# EAGLE schematic 4XKanda_1276_NoBME (EAGLE 7.7.0)

## Sheet 1 of 4
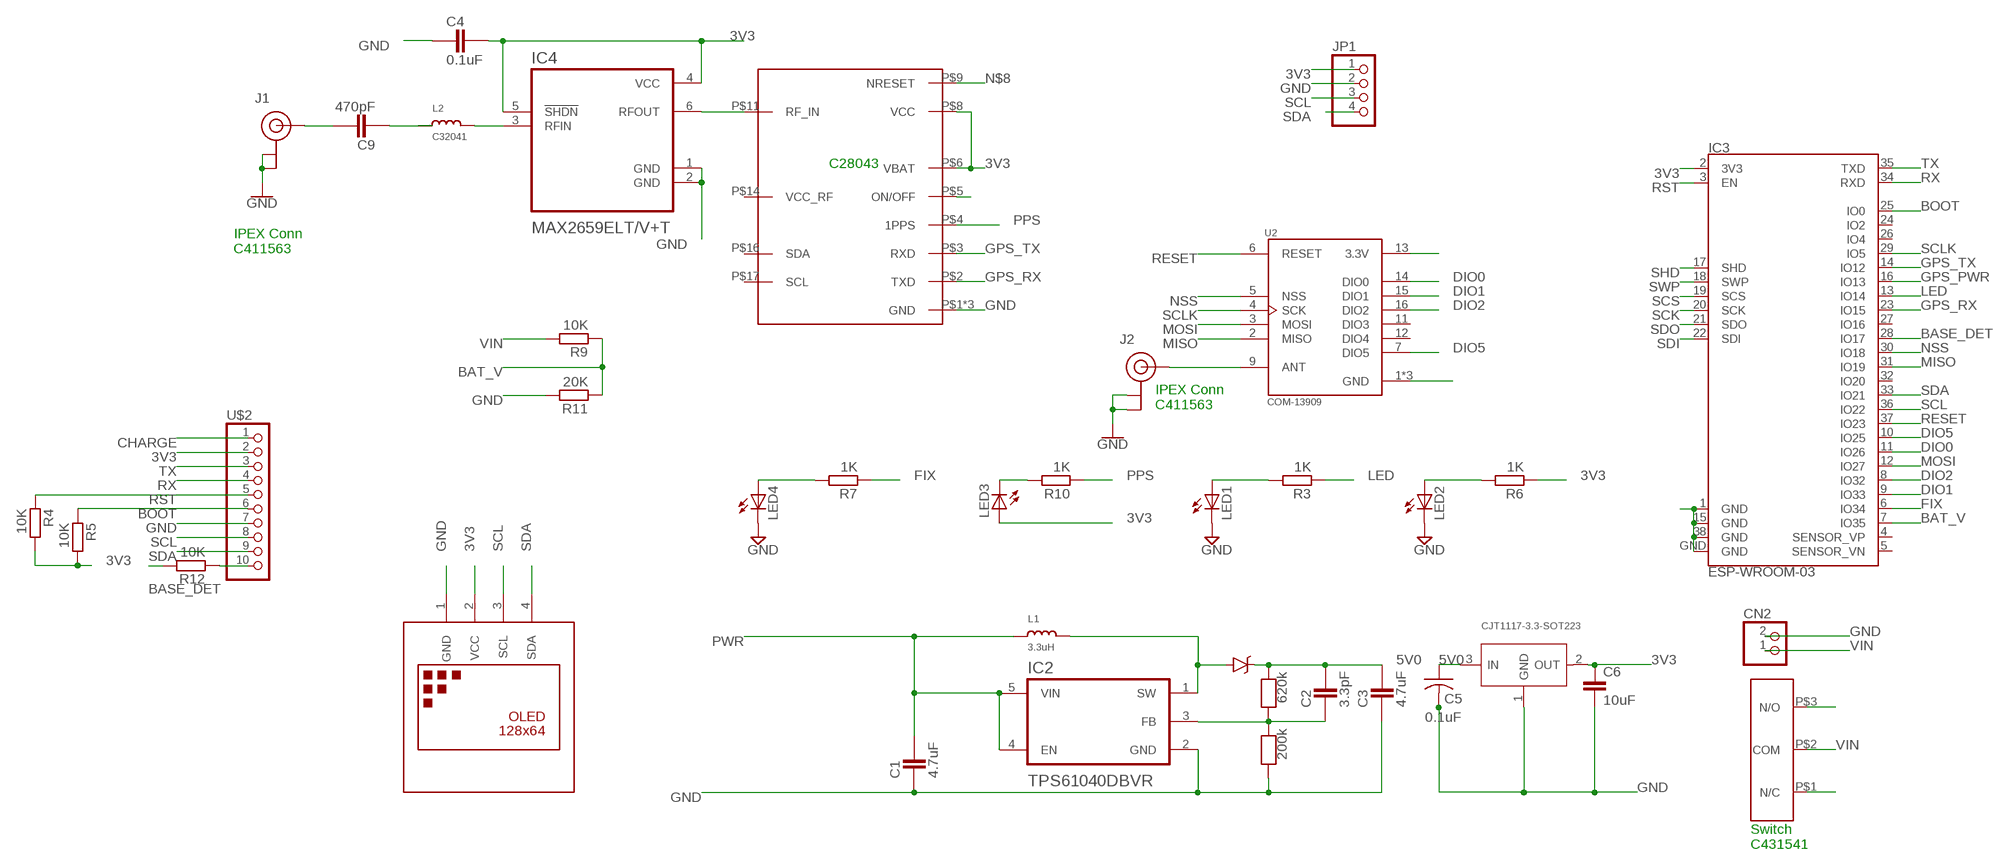
[diagram p0: schematic, sheet 1]

### Parts
C1  4.7uF  CAPACITOR_0603  [CAPC1608X92N]
C2  3.3pF  CAPACITOR_0402  [CAPC1005X60N]
C3  4.7uF  CAPACITOR_0603  [CAPC1608X92N]
C4  0.1uF  CAPACITOR_0603  [CAPC1608X92N]
C5  0.1uF  C-USC0805  [C0805]
C6  10uF  C-EUC0805  [C0805@1]
C9  470pF  CAPACITOR_0603  [CAPC1608X92N]
CN2  JST_2PIN-THM  [JST-PH-2-THM]
D1  BA340A  B340A  [SMA-DIODE]
IC1  CJT1117-3.3-SOT223  PMIC-CJT1117-3.3(SOT223)  [SOT-223]
IC2  TPS61040DBVR  [SOT95P280X145-5N]
IC3  ESP-WROOM-03  [ESP-WROOM-03]
IC4  MAX2659ELT/V+T  [SON50P150X100X80-6N]
IC54  ATGM336H  [ATGM336H]
J1  U.FL  [U.FL]
J2  U.FL  [U.FL]
JP1  HEADER-1X4ROUND  [1X04_ROUND]
L1  3.3uH  INDUCTORNR5040  [INDUCTOR_5X5MM_NR5040_NOTHERMALS]
L2  C32041  INDUCTOR_0402  [_0402]
LED1  LEDSML0805  [SML0805]
LED2  LEDSML0805  [SML0805]
LED3  LEDSML0805  [SML0805]
LED4  LEDSML0805  [SML0805]
R1  620k  RESISTOR0603  [0603]
R2  200k  RESISTOR0603  [0603]
R3  1K  RESISTOR_0603  [RESC1608X55N]
R4  10K  RESISTOR_0603  [RESC1608X55N]
R5  10K  RESISTOR_0603  [RESC1608X55N]
R6  1K  RESISTOR_0805  [RESC2012X70N]
R7  1K  RESISTOR_0603  [RESC1608X55N]
R9  10K  RESISTOR_0603  [RESC1608X55N]
R10  1K  RESISTOR_0603  [RESC1608X55N]
R11  20K  RESISTOR_0603  [RESC1608X55N]
R12  10K  RESISTOR_0603  [RESC1608X55N]
S1  SMD-SWITCH  [SMD-SWITCH]
U2  COM-13909  [MOD_COM-13909]
U$1  DISPLAY-OLED-128X64-I2C  [DISPLAY-OLED-128X64-I2C]
U$2  HEADER-1X10ROUND  [1X10_ROUND]

### Nets
3V3: C4.2 C6.1 IC1.2(OUT) IC3.2(3V3) IC4.4(VCC) IC4.5(!SHDN) IC54.P$6(VBAT) IC54.P$8(VCC) JP1.1 LED3.A R4.2 R5.2 R6.1 U2.13(3.3V) U$1.2(VCC) U$2.2 ; also sheet 2,3,4
5V0: C2.2 C3.2 C5.1 D1.C IC1.3(IN) R1.1 ; also sheet 2,3,4
ANT: J2.FEED(SIGNAL) U2.9(ANT)
BASE_DET: IC3.28(IO17) R12.2 ; also sheet 2,3,4
BAT_V: IC3.7(IO35) R9.1 R11.1 ; also sheet 2,3,4
BOOT: IC3.25(IO0) R5.1 U$2.6 ; also sheet 2,3,4
CHARGE: S1.P$3(N/O) U$2.1 ; also sheet 2,3,4
DIO0: IC3.11(IO26) U2.14(DIO0) ; also sheet 2,3,4
DIO1: IC3.9(IO33) U2.15(DIO1) ; also sheet 2,3,4
DIO2: IC3.8(IO32) U2.16(DIO2) ; also sheet 2,3,4
DIO5: IC3.10(IO25) U2.7(DIO5) ; also sheet 2,3,4
FB: C2.1 IC2.3(FB) R1.2 R2.1
FIX: IC3.6(IO34) R7.1 ; also sheet 2,3,4
GND: C1.1 C3.1 C4.1 C5.2 C6.2 CN2.2 IC1.1(GND) IC2.2(GND) IC3.1(GND) IC3.15(GND) IC3.38(GND) IC3.GND IC4.1(GND) IC4.2(GND) IC54.P$1(GND) IC54.P$10(GND) IC54.P$12(GND) J1.1(GND) J1.2(GND) J2.1(GND) J2.2(GND) JP1.2 LED1.C LED2.C LED4.C R2.2 R11.2 U2.1(GND) U2.8(GND) U2.10(GND) U$1.1(GND) U$2.7 ; also sheet 2,3,4
GPS_PWR: IC3.16(IO13) ; also sheet 2,3,4
GPS_RX: IC3.23(IO15) IC54.P$2(TXD) ; also sheet 2,3,4
GPS_TX: IC3.14(IO12) IC54.P$3(RXD) ; also sheet 2,3,4
LED: IC3.13(IO14) R3.1 ; also sheet 2,3,4
MISO: IC3.31(IO19) U2.2(MISO) ; also sheet 2,3,4
MOSI: IC3.12(IO27) U2.3(MOSI) ; also sheet 2,3,4
N$1: D1.A IC2.1(SW) L1.P$2
N$2: LED2.A R6.2
N$3: LED1.A R3.2
N$4: C9.2 J1.FEED(SIGNAL)
N$5: LED4.A R7.2
N$6: IC4.6(RFOUT) IC54.P$11(RF_IN)
N$7: LED3.C R10.2
N$8: IC54.P$9(NRESET) ; also sheet 2,3,4
N$9: IC54.P$5(ON/OFF)
N$11: IC4.3(RFIN) L2.2
N$12: C9.1 L2.1
N$13: R12.1 U$2.10
NSS: IC3.30(IO18) U2.5(NSS) ; also sheet 2,3,4
PPS: IC54.P$4(1PPS) R10.1 ; also sheet 2,3,4
PWR: C1.2 IC2.4(EN) IC2.5(VIN) L1.P$1 S1.P$1(N/C) ; also sheet 2,3,4
RESET: IC3.37(IO23) U2.6(RESET) ; also sheet 2,3,4
RST: IC3.3(EN) R4.1 U$2.5 ; also sheet 2,3,4
RX: IC3.34(RXD) U$2.4 ; also sheet 2,3,4
SCK: IC3.20(SCK) ; also sheet 2,3,4
SCL: IC3.36(IO22) JP1.3 U$1.3(SCL) U$2.8 ; also sheet 2,3,4
SCLK: IC3.29(IO5) U2.4(SCK) ; also sheet 2,3,4
SCS: IC3.19(SCS) ; also sheet 2,3,4
SDA: IC3.33(IO21) JP1.4 U$1.4(SDA) U$2.9 ; also sheet 2,3,4
SDI: IC3.22(SDI) ; also sheet 2,3,4
SDO: IC3.21(SDO) ; also sheet 2,3,4
SHD: IC3.17(SHD) ; also sheet 2,3,4
SWP: IC3.18(SWP) ; also sheet 2,3,4
TX: IC3.35(TXD) U$2.3 ; also sheet 2,3,4
VIN: CN2.1 R9.2 S1.P$2(COM) ; also sheet 2,3,4
Unconnected: IC3.4(SENSOR_VP) IC3.5(SENSOR_VN) IC3.24(IO2) IC3.26(IO4) IC3.27(IO16) IC3.32(IO20) IC54.P$14(VCC_RF) IC54.P$16(SDA) IC54.P$17(SCL) U2.11(DIO3) U2.12(DIO4)

### Notes on the sheet
- C28043
- IPEX Conn
  C411563
- IPEX Conn
  C411563
- Switch
  C431541

## Sheet 2 of 4
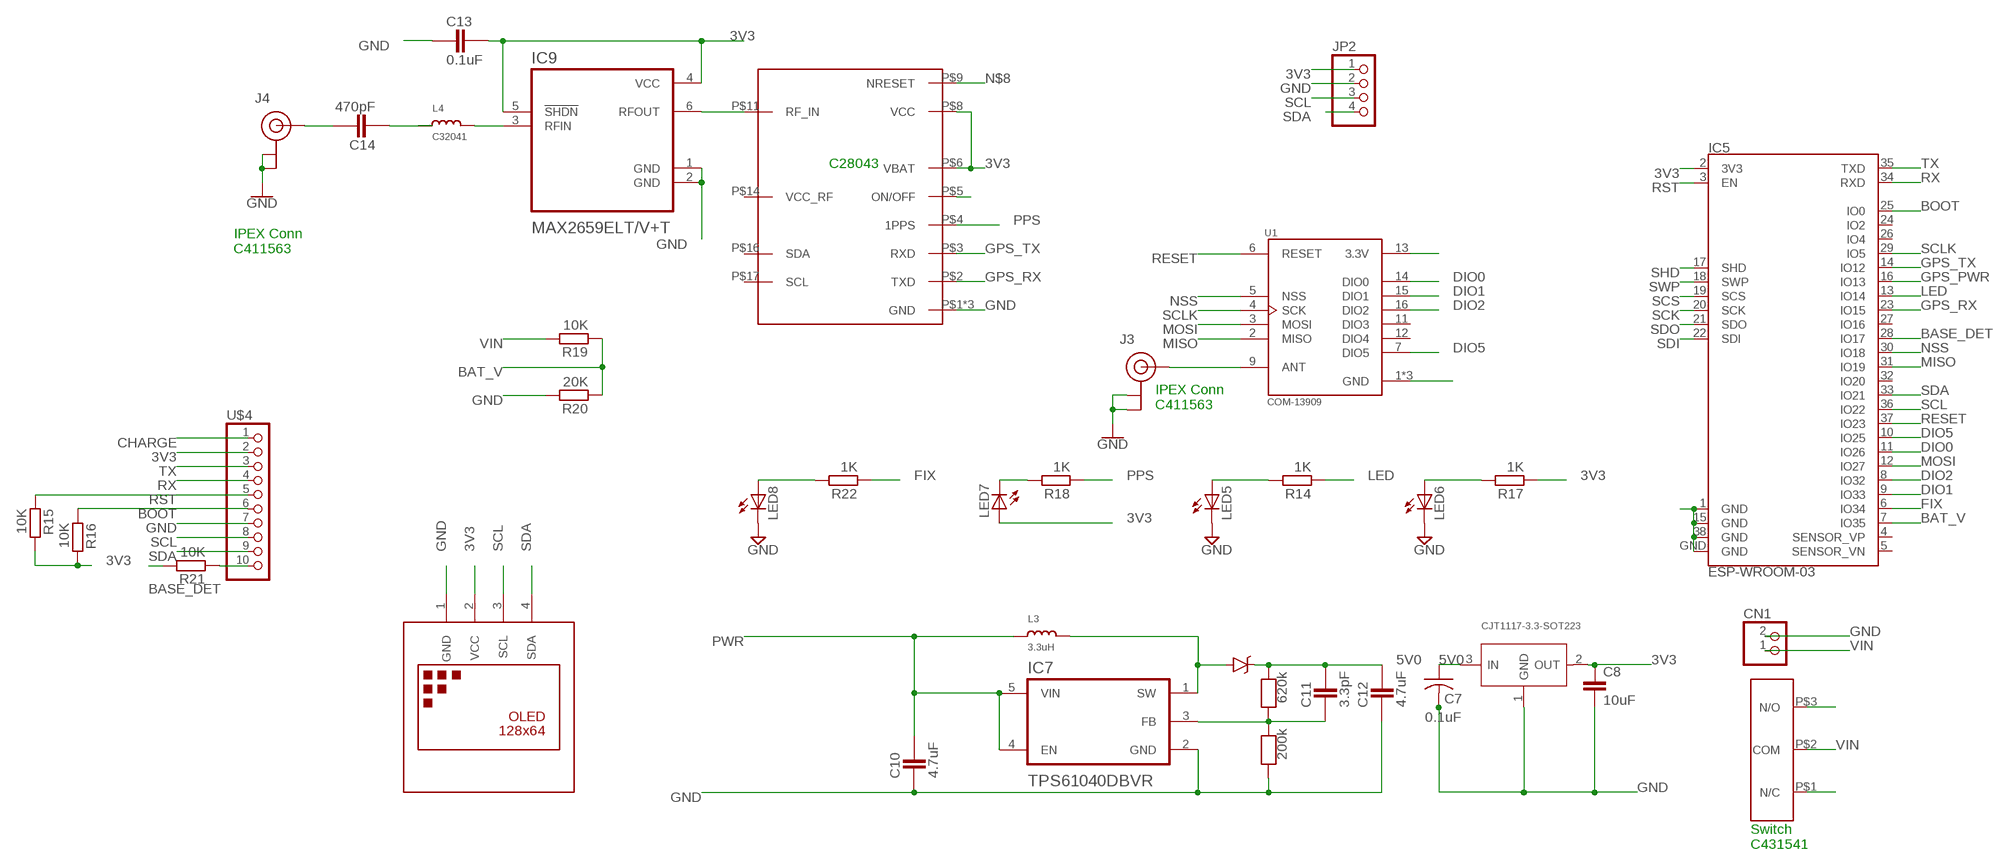
[diagram p1: schematic, sheet 2]

### Parts
C7  0.1uF  C-USC0805  [C0805]
C8  10uF  C-EUC0805  [C0805@1]
C10  4.7uF  CAPACITOR_0603  [CAPC1608X92N]
C11  3.3pF  CAPACITOR_0402  [CAPC1005X60N]
C12  4.7uF  CAPACITOR_0603  [CAPC1608X92N]
C13  0.1uF  CAPACITOR_0603  [CAPC1608X92N]
C14  470pF  CAPACITOR_0603  [CAPC1608X92N]
CN1  JST_2PIN-THM  [JST-PH-2-THM]
D2  BA340A  B340A  [SMA-DIODE]
IC5  ESP-WROOM-03  [ESP-WROOM-03]
IC6  CJT1117-3.3-SOT223  PMIC-CJT1117-3.3(SOT223)  [SOT-223]
IC7  TPS61040DBVR  [SOT95P280X145-5N]
IC8  ATGM336H  [ATGM336H]
IC9  MAX2659ELT/V+T  [SON50P150X100X80-6N]
J3  U.FL  [U.FL]
J4  U.FL  [U.FL]
JP2  HEADER-1X4ROUND  [1X04_ROUND]
L3  3.3uH  INDUCTORNR5040  [INDUCTOR_5X5MM_NR5040_NOTHERMALS]
L4  C32041  INDUCTOR_0402  [_0402]
LED5  LEDSML0805  [SML0805]
LED6  LEDSML0805  [SML0805]
LED7  LEDSML0805  [SML0805]
LED8  LEDSML0805  [SML0805]
R8  620k  RESISTOR0603  [0603]
R13  200k  RESISTOR0603  [0603]
R14  1K  RESISTOR_0603  [RESC1608X55N]
R15  10K  RESISTOR_0603  [RESC1608X55N]
R16  10K  RESISTOR_0603  [RESC1608X55N]
R17  1K  RESISTOR_0805  [RESC2012X70N]
R18  1K  RESISTOR_0603  [RESC1608X55N]
R19  10K  RESISTOR_0603  [RESC1608X55N]
R20  20K  RESISTOR_0603  [RESC1608X55N]
R21  10K  RESISTOR_0603  [RESC1608X55N]
R22  1K  RESISTOR_0603  [RESC1608X55N]
S2  SMD-SWITCH  [SMD-SWITCH]
U1  COM-13909  [MOD_COM-13909]
U$3  DISPLAY-OLED-128X64-I2C  [DISPLAY-OLED-128X64-I2C]
U$4  HEADER-1X10ROUND  [1X10_ROUND]

### Nets
3V3: C8.1 C13.2 IC5.2(3V3) IC6.2(OUT) IC8.P$6(VBAT) IC8.P$8(VCC) IC9.4(VCC) IC9.5(!SHDN) JP2.1 LED7.A R15.2 R16.2 R17.1 U1.13(3.3V) U$3.2(VCC) U$4.2 ; also sheet 1,3,4
5V0: C7.1 C11.2 C12.2 D2.C IC6.3(IN) R8.1 ; also sheet 1,3,4
ANT1: J3.FEED(SIGNAL) U1.9(ANT)
BASE_DET: IC5.28(IO17) R21.2 ; also sheet 1,3,4
BAT_V: IC5.7(IO35) R19.1 R20.1 ; also sheet 1,3,4
BOOT: IC5.25(IO0) R16.1 U$4.6 ; also sheet 1,3,4
CHARGE: S2.P$3(N/O) U$4.1 ; also sheet 1,3,4
DIO0: IC5.11(IO26) U1.14(DIO0) ; also sheet 1,3,4
DIO1: IC5.9(IO33) U1.15(DIO1) ; also sheet 1,3,4
DIO2: IC5.8(IO32) U1.16(DIO2) ; also sheet 1,3,4
DIO5: IC5.10(IO25) U1.7(DIO5) ; also sheet 1,3,4
FB1: C11.1 IC7.3(FB) R8.2 R13.1
FIX: IC5.6(IO34) R22.1 ; also sheet 1,3,4
GND: C7.2 C8.2 C10.1 C12.1 C13.1 CN1.2 IC5.1(GND) IC5.15(GND) IC5.38(GND) IC5.GND IC6.1(GND) IC7.2(GND) IC8.P$1(GND) IC8.P$10(GND) IC8.P$12(GND) IC9.1(GND) IC9.2(GND) J3.1(GND) J3.2(GND) J4.1(GND) J4.2(GND) JP2.2 LED5.C LED6.C LED8.C R13.2 R20.2 U1.1(GND) U1.8(GND) U1.10(GND) U$3.1(GND) U$4.7 ; also sheet 1,3,4
GPS_PWR: IC5.16(IO13) ; also sheet 1,3,4
GPS_RX: IC5.23(IO15) IC8.P$2(TXD) ; also sheet 1,3,4
GPS_TX: IC5.14(IO12) IC8.P$3(RXD) ; also sheet 1,3,4
LED: IC5.13(IO14) R14.1 ; also sheet 1,3,4
MISO: IC5.31(IO19) U1.2(MISO) ; also sheet 1,3,4
MOSI: IC5.12(IO27) U1.3(MOSI) ; also sheet 1,3,4
N$8: IC8.P$9(NRESET) ; also sheet 1,3,4
N$10: D2.A IC7.1(SW) L3.P$2
N$14: LED5.A R14.2
N$15: LED6.A R17.2
N$16: C14.2 J4.FEED(SIGNAL)
N$17: LED7.C R18.2
N$18: IC8.P$5(ON/OFF)
N$19: IC8.P$11(RF_IN) IC9.6(RFOUT)
N$20: IC9.3(RFIN) L4.2
N$21: C14.1 L4.1
N$22: R21.1 U$4.10
N$23: LED8.A R22.2
NSS: IC5.30(IO18) U1.5(NSS) ; also sheet 1,3,4
PPS: IC8.P$4(1PPS) R18.1 ; also sheet 1,3,4
PWR: C10.2 IC7.4(EN) IC7.5(VIN) L3.P$1 S2.P$1(N/C) ; also sheet 1,3,4
RESET: IC5.37(IO23) U1.6(RESET) ; also sheet 1,3,4
RST: IC5.3(EN) R15.1 U$4.5 ; also sheet 1,3,4
RX: IC5.34(RXD) U$4.4 ; also sheet 1,3,4
SCK: IC5.20(SCK) ; also sheet 1,3,4
SCL: IC5.36(IO22) JP2.3 U$3.3(SCL) U$4.8 ; also sheet 1,3,4
SCLK: IC5.29(IO5) U1.4(SCK) ; also sheet 1,3,4
SCS: IC5.19(SCS) ; also sheet 1,3,4
SDA: IC5.33(IO21) JP2.4 U$3.4(SDA) U$4.9 ; also sheet 1,3,4
SDI: IC5.22(SDI) ; also sheet 1,3,4
SDO: IC5.21(SDO) ; also sheet 1,3,4
SHD: IC5.17(SHD) ; also sheet 1,3,4
SWP: IC5.18(SWP) ; also sheet 1,3,4
TX: IC5.35(TXD) U$4.3 ; also sheet 1,3,4
VIN: CN1.1 R19.2 S2.P$2(COM) ; also sheet 1,3,4
Unconnected: IC5.4(SENSOR_VP) IC5.5(SENSOR_VN) IC5.24(IO2) IC5.26(IO4) IC5.27(IO16) IC5.32(IO20) IC8.P$14(VCC_RF) IC8.P$16(SDA) IC8.P$17(SCL) U1.11(DIO3) U1.12(DIO4)

### Notes on the sheet
- C28043
- IPEX Conn
  C411563
- IPEX Conn
  C411563
- Switch
  C431541

## Sheet 3 of 4
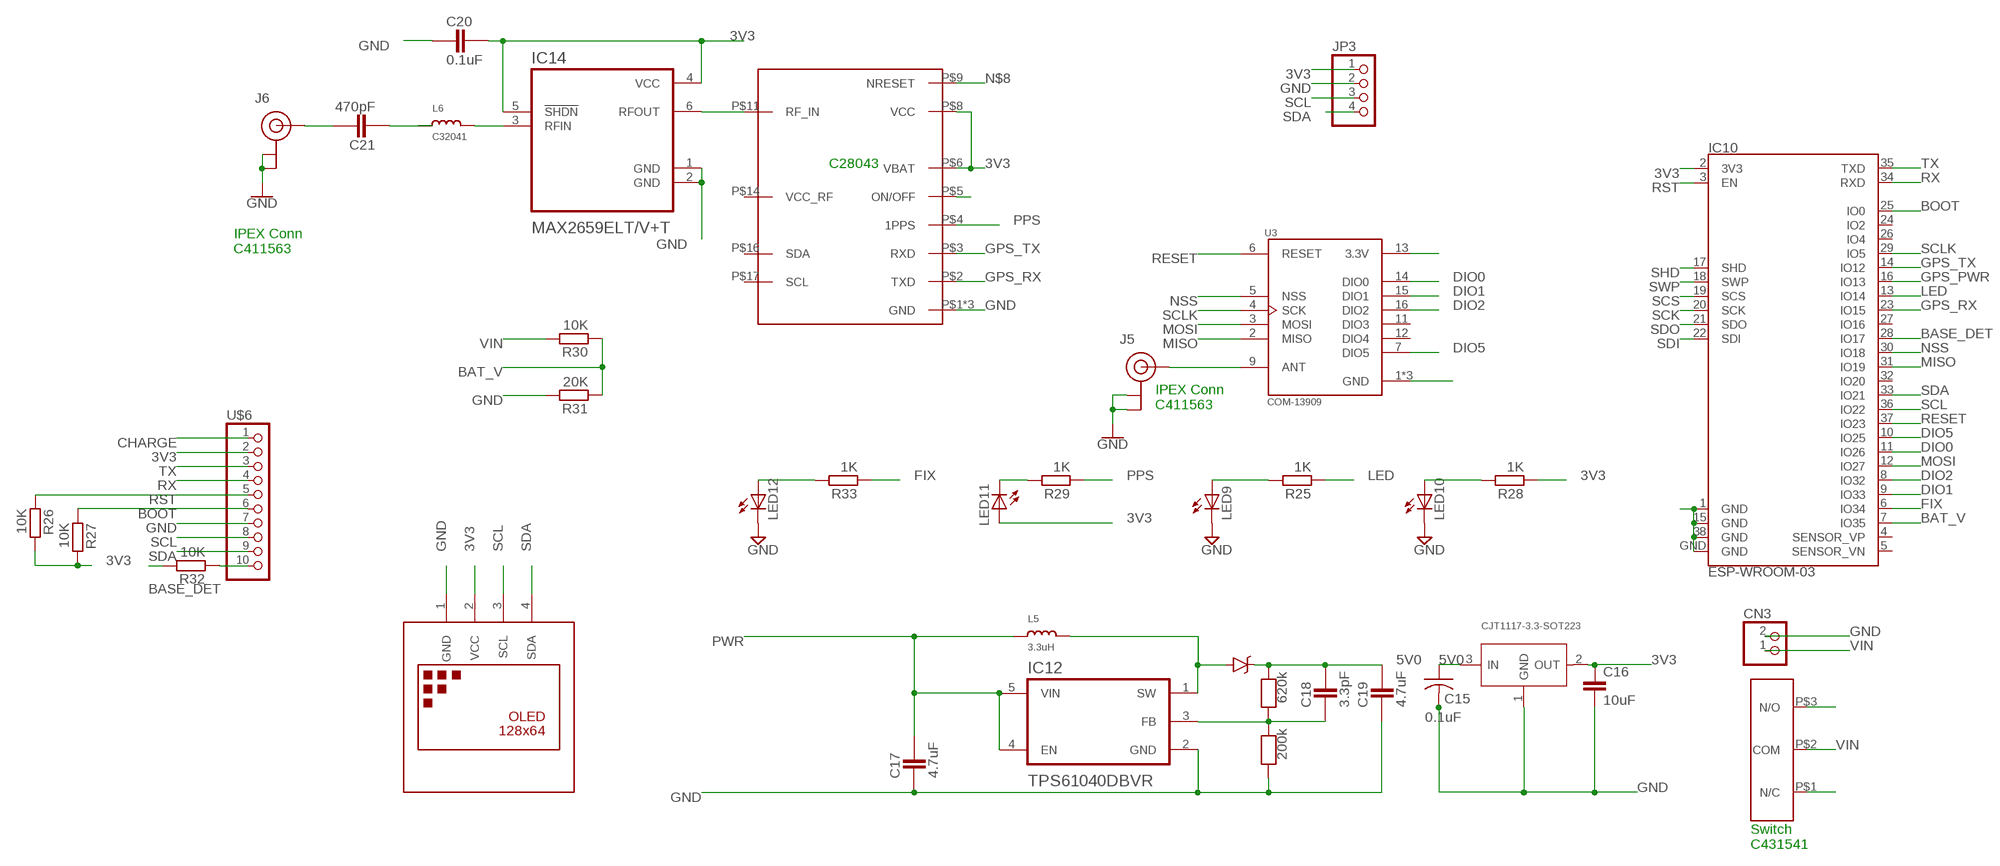
[diagram p2: schematic, sheet 3]

### Parts
C15  0.1uF  C-USC0805  [C0805]
C16  10uF  C-EUC0805  [C0805@1]
C17  4.7uF  CAPACITOR_0603  [CAPC1608X92N]
C18  3.3pF  CAPACITOR_0402  [CAPC1005X60N]
C19  4.7uF  CAPACITOR_0603  [CAPC1608X92N]
C20  0.1uF  CAPACITOR_0603  [CAPC1608X92N]
C21  470pF  CAPACITOR_0603  [CAPC1608X92N]
CN3  JST_2PIN-THM  [JST-PH-2-THM]
D3  BA340A  B340A  [SMA-DIODE]
IC10  ESP-WROOM-03  [ESP-WROOM-03]
IC11  CJT1117-3.3-SOT223  PMIC-CJT1117-3.3(SOT223)  [SOT-223]
IC12  TPS61040DBVR  [SOT95P280X145-5N]
IC13  ATGM336H  [ATGM336H]
IC14  MAX2659ELT/V+T  [SON50P150X100X80-6N]
J5  U.FL  [U.FL]
J6  U.FL  [U.FL]
JP3  HEADER-1X4ROUND  [1X04_ROUND]
L5  3.3uH  INDUCTORNR5040  [INDUCTOR_5X5MM_NR5040_NOTHERMALS]
L6  C32041  INDUCTOR_0402  [_0402]
LED9  LEDSML0805  [SML0805]
LED10  LEDSML0805  [SML0805]
LED11  LEDSML0805  [SML0805]
LED12  LEDSML0805  [SML0805]
R23  620k  RESISTOR0603  [0603]
R24  200k  RESISTOR0603  [0603]
R25  1K  RESISTOR_0603  [RESC1608X55N]
R26  10K  RESISTOR_0603  [RESC1608X55N]
R27  10K  RESISTOR_0603  [RESC1608X55N]
R28  1K  RESISTOR_0805  [RESC2012X70N]
R29  1K  RESISTOR_0603  [RESC1608X55N]
R30  10K  RESISTOR_0603  [RESC1608X55N]
R31  20K  RESISTOR_0603  [RESC1608X55N]
R32  10K  RESISTOR_0603  [RESC1608X55N]
R33  1K  RESISTOR_0603  [RESC1608X55N]
S3  SMD-SWITCH  [SMD-SWITCH]
U3  COM-13909  [MOD_COM-13909]
U$5  DISPLAY-OLED-128X64-I2C  [DISPLAY-OLED-128X64-I2C]
U$6  HEADER-1X10ROUND  [1X10_ROUND]

### Nets
3V3: C16.1 C20.2 IC10.2(3V3) IC11.2(OUT) IC13.P$6(VBAT) IC13.P$8(VCC) IC14.4(VCC) IC14.5(!SHDN) JP3.1 LED11.A R26.2 R27.2 R28.1 U3.13(3.3V) U$5.2(VCC) U$6.2 ; also sheet 1,2,4
5V0: C15.1 C18.2 C19.2 D3.C IC11.3(IN) R23.1 ; also sheet 1,2,4
ANT2: J5.FEED(SIGNAL) U3.9(ANT)
BASE_DET: IC10.28(IO17) R32.2 ; also sheet 1,2,4
BAT_V: IC10.7(IO35) R30.1 R31.1 ; also sheet 1,2,4
BOOT: IC10.25(IO0) R27.1 U$6.6 ; also sheet 1,2,4
CHARGE: S3.P$3(N/O) U$6.1 ; also sheet 1,2,4
DIO0: IC10.11(IO26) U3.14(DIO0) ; also sheet 1,2,4
DIO1: IC10.9(IO33) U3.15(DIO1) ; also sheet 1,2,4
DIO2: IC10.8(IO32) U3.16(DIO2) ; also sheet 1,2,4
DIO5: IC10.10(IO25) U3.7(DIO5) ; also sheet 1,2,4
FB2: C18.1 IC12.3(FB) R23.2 R24.1
FIX: IC10.6(IO34) R33.1 ; also sheet 1,2,4
GND: C15.2 C16.2 C17.1 C19.1 C20.1 CN3.2 IC10.1(GND) IC10.15(GND) IC10.38(GND) IC10.GND IC11.1(GND) IC12.2(GND) IC13.P$1(GND) IC13.P$10(GND) IC13.P$12(GND) IC14.1(GND) IC14.2(GND) J5.1(GND) J5.2(GND) J6.1(GND) J6.2(GND) JP3.2 LED9.C LED10.C LED12.C R24.2 R31.2 U3.1(GND) U3.8(GND) U3.10(GND) U$5.1(GND) U$6.7 ; also sheet 1,2,4
GPS_PWR: IC10.16(IO13) ; also sheet 1,2,4
GPS_RX: IC10.23(IO15) IC13.P$2(TXD) ; also sheet 1,2,4
GPS_TX: IC10.14(IO12) IC13.P$3(RXD) ; also sheet 1,2,4
LED: IC10.13(IO14) R25.1 ; also sheet 1,2,4
MISO: IC10.31(IO19) U3.2(MISO) ; also sheet 1,2,4
MOSI: IC10.12(IO27) U3.3(MOSI) ; also sheet 1,2,4
N$8: IC13.P$9(NRESET) ; also sheet 1,2,4
N$24: D3.A IC12.1(SW) L5.P$2
N$25: LED9.A R25.2
N$26: LED10.A R28.2
N$27: C21.2 J6.FEED(SIGNAL)
N$28: LED11.C R29.2
N$29: IC13.P$5(ON/OFF)
N$30: IC13.P$11(RF_IN) IC14.6(RFOUT)
N$31: IC14.3(RFIN) L6.2
N$32: C21.1 L6.1
N$33: R32.1 U$6.10
N$34: LED12.A R33.2
NSS: IC10.30(IO18) U3.5(NSS) ; also sheet 1,2,4
PPS: IC13.P$4(1PPS) R29.1 ; also sheet 1,2,4
PWR: C17.2 IC12.4(EN) IC12.5(VIN) L5.P$1 S3.P$1(N/C) ; also sheet 1,2,4
RESET: IC10.37(IO23) U3.6(RESET) ; also sheet 1,2,4
RST: IC10.3(EN) R26.1 U$6.5 ; also sheet 1,2,4
RX: IC10.34(RXD) U$6.4 ; also sheet 1,2,4
SCK: IC10.20(SCK) ; also sheet 1,2,4
SCL: IC10.36(IO22) JP3.3 U$5.3(SCL) U$6.8 ; also sheet 1,2,4
SCLK: IC10.29(IO5) U3.4(SCK) ; also sheet 1,2,4
SCS: IC10.19(SCS) ; also sheet 1,2,4
SDA: IC10.33(IO21) JP3.4 U$5.4(SDA) U$6.9 ; also sheet 1,2,4
SDI: IC10.22(SDI) ; also sheet 1,2,4
SDO: IC10.21(SDO) ; also sheet 1,2,4
SHD: IC10.17(SHD) ; also sheet 1,2,4
SWP: IC10.18(SWP) ; also sheet 1,2,4
TX: IC10.35(TXD) U$6.3 ; also sheet 1,2,4
VIN: CN3.1 R30.2 S3.P$2(COM) ; also sheet 1,2,4
Unconnected: IC10.4(SENSOR_VP) IC10.5(SENSOR_VN) IC10.24(IO2) IC10.26(IO4) IC10.27(IO16) IC10.32(IO20) IC13.P$14(VCC_RF) IC13.P$16(SDA) IC13.P$17(SCL) U3.11(DIO3) U3.12(DIO4)

### Notes on the sheet
- C28043
- IPEX Conn
  C411563
- IPEX Conn
  C411563
- Switch
  C431541

## Sheet 4 of 4
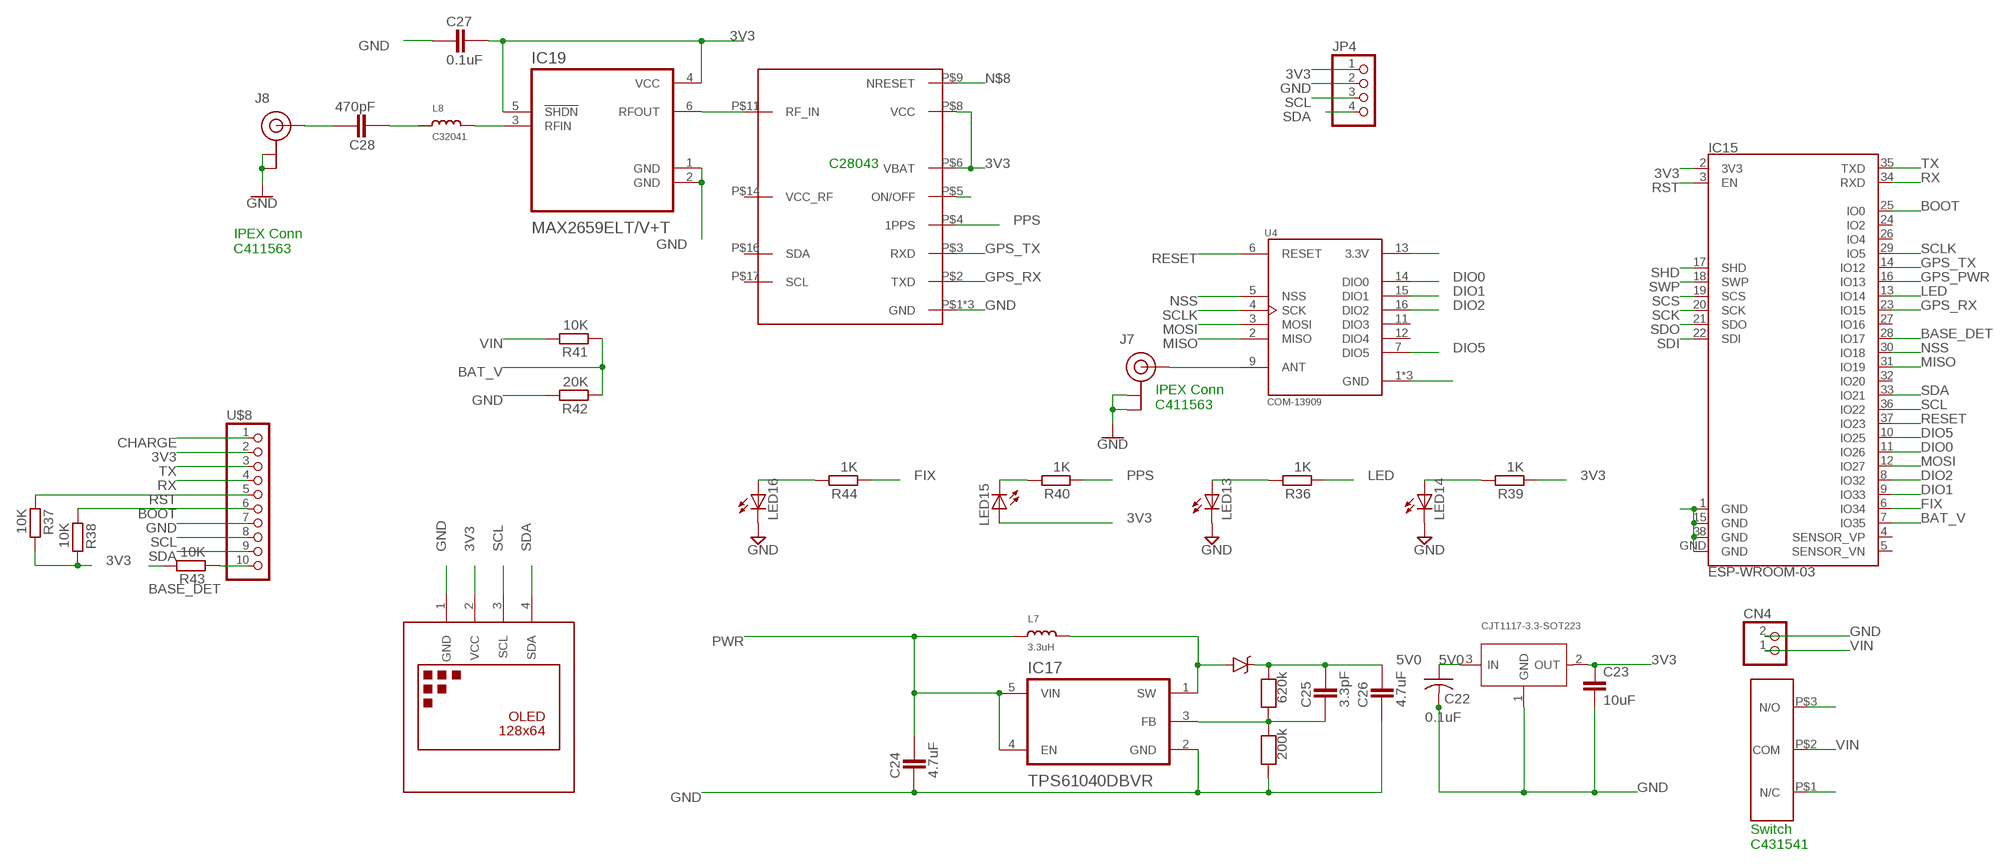
[diagram p3: schematic, sheet 4]

### Parts
C22  0.1uF  C-USC0805  [C0805]
C23  10uF  C-EUC0805  [C0805@1]
C24  4.7uF  CAPACITOR_0603  [CAPC1608X92N]
C25  3.3pF  CAPACITOR_0402  [CAPC1005X60N]
C26  4.7uF  CAPACITOR_0603  [CAPC1608X92N]
C27  0.1uF  CAPACITOR_0603  [CAPC1608X92N]
C28  470pF  CAPACITOR_0603  [CAPC1608X92N]
CN4  JST_2PIN-THM  [JST-PH-2-THM]
D4  BA340A  B340A  [SMA-DIODE]
IC15  ESP-WROOM-03  [ESP-WROOM-03]
IC16  CJT1117-3.3-SOT223  PMIC-CJT1117-3.3(SOT223)  [SOT-223]
IC17  TPS61040DBVR  [SOT95P280X145-5N]
IC18  ATGM336H  [ATGM336H]
IC19  MAX2659ELT/V+T  [SON50P150X100X80-6N]
J7  U.FL  [U.FL]
J8  U.FL  [U.FL]
JP4  HEADER-1X4ROUND  [1X04_ROUND]
L7  3.3uH  INDUCTORNR5040  [INDUCTOR_5X5MM_NR5040_NOTHERMALS]
L8  C32041  INDUCTOR_0402  [_0402]
LED13  LEDSML0805  [SML0805]
LED14  LEDSML0805  [SML0805]
LED15  LEDSML0805  [SML0805]
LED16  LEDSML0805  [SML0805]
R34  620k  RESISTOR0603  [0603]
R35  200k  RESISTOR0603  [0603]
R36  1K  RESISTOR_0603  [RESC1608X55N]
R37  10K  RESISTOR_0603  [RESC1608X55N]
R38  10K  RESISTOR_0603  [RESC1608X55N]
R39  1K  RESISTOR_0805  [RESC2012X70N]
R40  1K  RESISTOR_0603  [RESC1608X55N]
R41  10K  RESISTOR_0603  [RESC1608X55N]
R42  20K  RESISTOR_0603  [RESC1608X55N]
R43  10K  RESISTOR_0603  [RESC1608X55N]
R44  1K  RESISTOR_0603  [RESC1608X55N]
S4  SMD-SWITCH  [SMD-SWITCH]
U4  COM-13909  [MOD_COM-13909]
U$7  DISPLAY-OLED-128X64-I2C  [DISPLAY-OLED-128X64-I2C]
U$8  HEADER-1X10ROUND  [1X10_ROUND]

### Nets
3V3: C23.1 C27.2 IC15.2(3V3) IC16.2(OUT) IC18.P$6(VBAT) IC18.P$8(VCC) IC19.4(VCC) IC19.5(!SHDN) JP4.1 LED15.A R37.2 R38.2 R39.1 U4.13(3.3V) U$7.2(VCC) U$8.2 ; also sheet 1,2,3
5V0: C22.1 C25.2 C26.2 D4.C IC16.3(IN) R34.1 ; also sheet 1,2,3
ANT3: J7.FEED(SIGNAL) U4.9(ANT)
BASE_DET: IC15.28(IO17) R43.2 ; also sheet 1,2,3
BAT_V: IC15.7(IO35) R41.1 R42.1 ; also sheet 1,2,3
BOOT: IC15.25(IO0) R38.1 U$8.6 ; also sheet 1,2,3
CHARGE: S4.P$3(N/O) U$8.1 ; also sheet 1,2,3
DIO0: IC15.11(IO26) U4.14(DIO0) ; also sheet 1,2,3
DIO1: IC15.9(IO33) U4.15(DIO1) ; also sheet 1,2,3
DIO2: IC15.8(IO32) U4.16(DIO2) ; also sheet 1,2,3
DIO5: IC15.10(IO25) U4.7(DIO5) ; also sheet 1,2,3
FB3: C25.1 IC17.3(FB) R34.2 R35.1
FIX: IC15.6(IO34) R44.1 ; also sheet 1,2,3
GND: C22.2 C23.2 C24.1 C26.1 C27.1 CN4.2 IC15.1(GND) IC15.15(GND) IC15.38(GND) IC15.GND IC16.1(GND) IC17.2(GND) IC18.P$1(GND) IC18.P$10(GND) IC18.P$12(GND) IC19.1(GND) IC19.2(GND) J7.1(GND) J7.2(GND) J8.1(GND) J8.2(GND) JP4.2 LED13.C LED14.C LED16.C R35.2 R42.2 U4.1(GND) U4.8(GND) U4.10(GND) U$7.1(GND) U$8.7 ; also sheet 1,2,3
GPS_PWR: IC15.16(IO13) ; also sheet 1,2,3
GPS_RX: IC15.23(IO15) IC18.P$2(TXD) ; also sheet 1,2,3
GPS_TX: IC15.14(IO12) IC18.P$3(RXD) ; also sheet 1,2,3
LED: IC15.13(IO14) R36.1 ; also sheet 1,2,3
MISO: IC15.31(IO19) U4.2(MISO) ; also sheet 1,2,3
MOSI: IC15.12(IO27) U4.3(MOSI) ; also sheet 1,2,3
N$8: IC18.P$9(NRESET) ; also sheet 1,2,3
N$35: D4.A IC17.1(SW) L7.P$2
N$36: LED13.A R36.2
N$37: LED14.A R39.2
N$38: C28.2 J8.FEED(SIGNAL)
N$39: LED15.C R40.2
N$40: IC18.P$5(ON/OFF)
N$41: IC18.P$11(RF_IN) IC19.6(RFOUT)
N$42: IC19.3(RFIN) L8.2
N$43: C28.1 L8.1
N$44: R43.1 U$8.10
N$45: LED16.A R44.2
NSS: IC15.30(IO18) U4.5(NSS) ; also sheet 1,2,3
PPS: IC18.P$4(1PPS) R40.1 ; also sheet 1,2,3
PWR: C24.2 IC17.4(EN) IC17.5(VIN) L7.P$1 S4.P$1(N/C) ; also sheet 1,2,3
RESET: IC15.37(IO23) U4.6(RESET) ; also sheet 1,2,3
RST: IC15.3(EN) R37.1 U$8.5 ; also sheet 1,2,3
RX: IC15.34(RXD) U$8.4 ; also sheet 1,2,3
SCK: IC15.20(SCK) ; also sheet 1,2,3
SCL: IC15.36(IO22) JP4.3 U$7.3(SCL) U$8.8 ; also sheet 1,2,3
SCLK: IC15.29(IO5) U4.4(SCK) ; also sheet 1,2,3
SCS: IC15.19(SCS) ; also sheet 1,2,3
SDA: IC15.33(IO21) JP4.4 U$7.4(SDA) U$8.9 ; also sheet 1,2,3
SDI: IC15.22(SDI) ; also sheet 1,2,3
SDO: IC15.21(SDO) ; also sheet 1,2,3
SHD: IC15.17(SHD) ; also sheet 1,2,3
SWP: IC15.18(SWP) ; also sheet 1,2,3
TX: IC15.35(TXD) U$8.3 ; also sheet 1,2,3
VIN: CN4.1 R41.2 S4.P$2(COM) ; also sheet 1,2,3
Unconnected: IC15.4(SENSOR_VP) IC15.5(SENSOR_VN) IC15.24(IO2) IC15.26(IO4) IC15.27(IO16) IC15.32(IO20) IC18.P$14(VCC_RF) IC18.P$16(SDA) IC18.P$17(SCL) U4.11(DIO3) U4.12(DIO4)

### Notes on the sheet
- C28043
- IPEX Conn
  C411563
- IPEX Conn
  C411563
- Switch
  C431541

## Library data of the parts
C1-C4 C9-C14 C17-C21 C24-C28 = ipc-7351-capacitor:CAPACITOR_
C5 C7 C15 C22 = resistor:C-US: CAPACITOR, American symbol
C6 C8 C16 C23 = resistor:C-EU: CAPACITOR, European symbol
CN1-CN4 = adafruit:JST_2PIN: JST 2-Pin Connectors of various flavors SMT-RA (S2B-PH-SM4) 4UConnector #17311 SMT (B2B-PH-SM4) THM-RA (S2B-PH) THM (B2B-PH)
D1-D4 = SparkFun-DiscreteSemi (Jaret’s MacBook Pro's conflicted copy 2016-01-31):B340A: Schottky Diode 3A-40V; PROD_ID: DIO-09886
IC1 IC6 IC11 IC16 = Seeed-IC:PMIC-CJT1117-3.3(SOT223): 310030097; MPN: CJT1117-3.3
IC2 IC7 IC12 IC17 = TPS61040DBVR:TPS61040DBVR: Check prices <https://snapeda.com/parts/TPS61040DBVR/Texas%20Instruments/view-part/?ref=eda>; AVAILABILITY: Good; DESCRIPTION: 28-V, 400-mA Switch Boost Converter in SOT-23 for LCD and White LED Applications 5-SOT-23 -40 to 85; DIGIKEY-PURCHASE-URL: https://snapeda.com/shop?store=DigiKey&id=218715; MF: Texas Instruments; MOUSER-PURCHASE-URL: https://snapeda.com/shop?store=Mouser&id=218715; MP: TPS61040DBVR; PACKAGE: SOT-23-5 Texas Instruments; PRICE: None; TEXAS_INSTRUMENTS-PURCHASE-URL: https://snapeda.com/shop?store=Texas+Instruments&id=218715
IC3 IC5 IC10 IC15 = esp32:ESP-WROOM-03
IC4 IC9 IC14 IC19 = MAX2659ELT_V_T:MAX2659ELT/V+T: Check prices <https://pricing.snapeda.com/parts/MAX2659ELT/V%2B/Maxim%20Integrated/view-part?ref=eda>; AVAILABILITY: Bad; DESCRIPTION: RF Amplifier IC GPS/GNSS 1575.42MHz 6-uDFN (1.5x1.0); MF: Maxim Integrated; MP: MAX2659ELT/V+; PACKAGE: &amp;MICRO;DFN-6 Maxim; PRICE: None
IC8 IC13 IC18 IC54 = microbuilder:ATGM336H
J1-J8 = SparkFun-Connectors:U.FL: SMD Antenna Connector - U.FL 2mm height, 3.0mm x 3.0mm receptacle size. SparkFun Products: SparkFun WiFi Shield - ESP8266 <https://www.sparkfun.com/products/13287> SparkFun ESP8266 Thing <https://www.sparkfun.com/products/13231> SparkFun MiniGen - Pro Mini Signal Generator Shield <https://www.sparkfun.com/products/11420>; PROD_ID: CONN-09193; SF_ID: WRL-09144
JP1-JP4 = microbuilder:HEADER-1X4: PIN HEADER
L1-L8 = microbuilder:INDUCTOR: Inductors 0603: 10nH Ceramic Inductor - microwire antenna/RF (Digikey: 712-1434-2-ND) 0805: 560nH Ceramic Inductor - RF (Digikey: 553-1047-1-ND) 270nH Ceramic Inductor - Q = 40@250MHz, +-5%, 1 Ohm DC Resistance (Digikey: 535-10506-2-ND) 1007 (2518 Metric) SMT: 10µH 10% 250mOhm 820mA 1007 Inductor (Digikey: 587-2189-1-ND) 22µH 10% 500mOhm 580mA 1007 Inductor (Digikey: 587-2190-1-ND) 47µH 10% 950mOhm 420mA 1007 Inductor (Digikey: 587-2191-1-ND) 47µH 5% 100mOhm 1A 1008 Inductor (Digikey: 732-1816-1-ND) 5.0x5.0mm (Taiyo Yuden NR5040 Series) 6.8µH 20% 2.3A 64mOhm Inductor (Digikey: 587-2374-2-ND) 5.0x5.0mm (TDK VLC5045 Series) 4.7µH 20% 3.3A 34mOhm Inductor (Digikey: 445-6526-1-ND) 6.8µH 20% 2.7A 46mOhm Inductor (Digikey: 445-6527-1-ND) 6.0x6.0mm (TDK VLC6045 Series) 4.7µH 20% 3.8A 27mOhm Inductor (Digikey: 445-6538-2-ND) 6.8µH 20% 3A 41mOhm Inductor (Digikey: 445-6540-1-ND) 6.2µH 30% 2.2A 45mOhm Inductor (Digikey: SRR5028-6R2YCT-ND) - Not TDK VLC6045 but footprint should match 6.0x6.0mm (TDK SLF6045 Series) 6.8uH 30% 2A 33mOhm Inductor (Digikey: 445-4572-1-ND, Mouser: 810-SLF645T6R8N2R0PF)
LED1-LED16 = led:LED: LED OSRAM: - CHIPLED LG R971, LG N971, LY N971, LG Q971, LY Q971, LO R971, LY R971 LH N974, LH R974 LS Q976, LO Q976, LY Q976 LO Q996 - Hyper CHIPLED LW Q18S LB Q993, LB Q99A, LB R99A - SideLED LS A670, LO A670, LY A670, LG A670, LP A670 LB A673, LV A673, LT A673, LW A673 LH A674 LY A675 LS A676, LA A676, LO A676, LY A676, LW A676 LS A679, LY A679, LG A679 - Hyper Micro SIDELED® LS Y876, LA Y876, LO Y876, LY Y876 LT Y87S - SmartLED LW L88C, LW L88S LB L89C, LB L89S, LG L890 LS L89K, LO L89K, LY L89K LS L896, LA L896, LO L896, LY L896 - TOPLED LS T670, LO T670, LY T670, LG T670, LP T670 LSG T670, LSP T670, LSY T670, LOP T670, LYG T670 LG T671, LOG T671, LSG T671 LB T673, LV T673, LT T673, LW T673 LH T674 LS T676, LA T676, LO T676, LY T676, LB T676, LH T676, LSB T676, LW T676 LB T67C, LV T67C, LT T67C, LS T67K, LO T67K, LY T67K, LW E67C LS E67B, LA E67B, LO E67B, LY E67B, LB E67C, LV E67C, LT E67C LW T67C LS T679, LY T679, LG T679 LS T770, LO T770, LY T770, LG T770, LP T770 LB T773, LV T773, LT T773, LW T773 LH T774 LS E675, LA E675, LY E675, LS T675 LS T776, LA T776, LO T776, LY T776, LB T776 LHGB T686 LT T68C, LB T68C - Hyper Mini TOPLED® LB M676 - Mini TOPLED Santana® LG M470 LS M47K, LO M47K, LY M47K Source: http://www.osram.convergy.de LUXEON: - LUMILED® LXK2-PW12-R00, LXK2-PW12-S00, LXK2-PW14-U00, LXK2-PW14-V00 LXK2-PM12-R00, LXK2-PM12-S00, LXK2-PM14-U00 LXK2-PE12-Q00, LXK2-PE12-R00, LXK2-PE12-S00, LXK2-PE14-T00, LXK2-PE14-U00 LXK2-PB12-K00, LXK2-PB12-L00, LXK2-PB12-M00, LXK2-PB14-N00, LXK2-PB14-P00, LXK2-PB14-Q00 LXK2-PR12-L00, LXK2-PR12-M00, LXK2-PR14-Q00, LXK2-PR14-R00 LXK2-PD12-Q00, LXK2-PD12-R00, LXK2-PD12-S00 LXK2-PH12-R00, LXK2-PH12-S00 LXK2-PL12-P00, LXK2-PL12-Q00, LXK2-PL12-R00 Source: www.luxeon.com KINGBRIGHT: KA-3528ASYC Source: www.kingbright.com
R1 R2 R8 R13 R23 R24 R34 R35 = microbuilder:RESISTOR: Resistors 0402 - 0402 Surface Mount Package 22 Ohm 1% 1/16W [Digikey: 311-22.0LRTR-ND] 33 Ohm 5% 1/16W 1.0K 5% 1/16W 1.5K 5% 1/16W 2.0K 1% 1/16W 10.0K 1% 1/16W [Digikey: 311-10.0KLRTR-ND] 10.0K 5% 1/16W [Digikey: RMCF0402JT10K0TR-ND] 12.1K 1% 1/16W [Digikey: 311-22.0LRTR-ND] 100.0K 5% 1/16W 0603 - 0603 Surface Mount Package 0 Ohm 1/10 Watt 1% Resistor 15 Ohm 1/10 Watt 1% Resistor 33 Ohm 1/10 Watt 1% Resistor 49.9 Ohm 1/10 Watt 1% Resistor 100 Ohm 1/10 Watt 1% Resistor 150 Ohm 1/10 Watt 1% Resistor 240 Ohm 1/10 Watt 1% Resistor 390 Ohm 1/10 Watt 1% Resistor 560 Ohm 1/10 Watt 1% Resistor 680 Ohm 1/10 Watt 1% Resistor 750 Ohm 1/10 Watt 1% Resistor 1.0K Ohm 1/10 Watt 1% Resistor 1.5K Ohm 1/10 Watt 1% Resistor 2.0K Ohm 1/10 Watt 1% Resistor 2.2K Ohm 1/10 Watt 1% Resistor 3.3K Ohm 1/10 Watt 1% Resistor 4.7K Ohm 1/10 Watt 1% Resistor 10.0K Ohm 1/10 Watt 1% Resistor 12.0K Ohm 1/10 Watt 1% Resistor 12.1K Ohm 1/10 Watt 1% Resistor 20.0K Ohm 1/10 Watt 1% Resistor 33.0K Ohm 1/10 Watt 1% Resistor 100.0K Ohm 1/10 Watt 1% Resistor 0805 - 0805 Surface Mount Package 0 Ohm 1/8 Watt 1% Resistor 33 Ohm 1/8 Watt 1% Resistor 100 Ohm 1/8 Watt 1% Resistor 150 Ohm 1/8 Watt 1% Resistor 200 Ohm 1/8 Watt 1% Resistor 240 Ohm 1/8 Watt 1% Resistor 330 Ohm 1/8 Watt 1% Resistor 390 Ohm 1/8 Watt 1% Resistor 470 Ohm 1/8 Watt 1% Resistor 1.0K Ohm 1/8 Watt 1% Resistor 1.5K Ohm 1/8 Watt 1% Resistor 2.0K Ohm 1/8 Watt 1% Resistor 4.7K Ohm 1/8 Watt 1% Resistor 5.1K Ohm 1/8 Watt 1% Resistor 5.6K Ohm 1/8 Watt 1% Resistor 10.0K Ohm 1/8 Watt 1% Resistor 22.0K Ohm 1/8 Watt 1% Resistor 33.0K Ohm 1/8 Watt 1% Resistor 100K Ohm 1/8 Watt 1% Resistor 1206 - 1206 Surface Mount Package 2012 - 2010 Surface Mount Package 0.11 Ohm 1/2 Watt 1% Resistor - Digikey: RHM.11UCT-ND
R3-R7 R9-R12 R14-R22 R25-R33 R36-R44 = ipc-7351-resistor:RESISTOR_
S1-S4 = pinhead:SMD-SWITCH
U1-U4 = COM-13909:COM-13909: Rfm69hcw Wireless Transceiver 91; AVAILABILITY: Unavailable; DESCRIPTION: General ISM < 1GHz Transceiver Module 915MHz Surface Mount; MF: HOPERF; MP: RFM69HCW-315S2; PACKAGE: Module SparkFun Electronics; PRICE: None
U$1 U$3 U$5 U$7 = diy-modules:DISPLAY-OLED-128X64-I2C
U$2 U$4 U$6 U$8 = microbuilder:HEADER-1X10: PIN HEADER

## Net classes
0 default: width 0.254 mm, drill 0.305 mm, clearance 0.152 mm